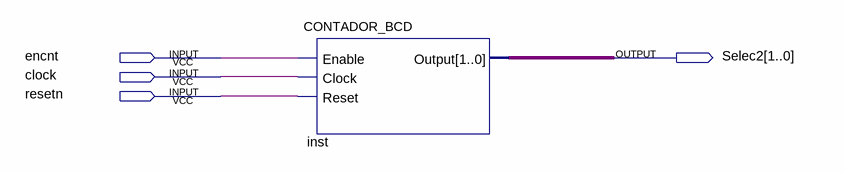
[diagram p0: schematic sheet]
// Quartus schematic bloque.bdf as structural Verilog: 1 symbols, 4 pins
module bloque (
  input  encnt,
  input  clock,
  input  resetn,
  output [1:0] Selec2
);

  CONTADOR_BCD inst (.Enable(encnt), .Clock(clock), .Reset(resetn), .Output(Selec2));
endmodule
